# Altium schematic sheet [04]-FT601_USB_Tx_Rx_Interface.SchDoc
size A3
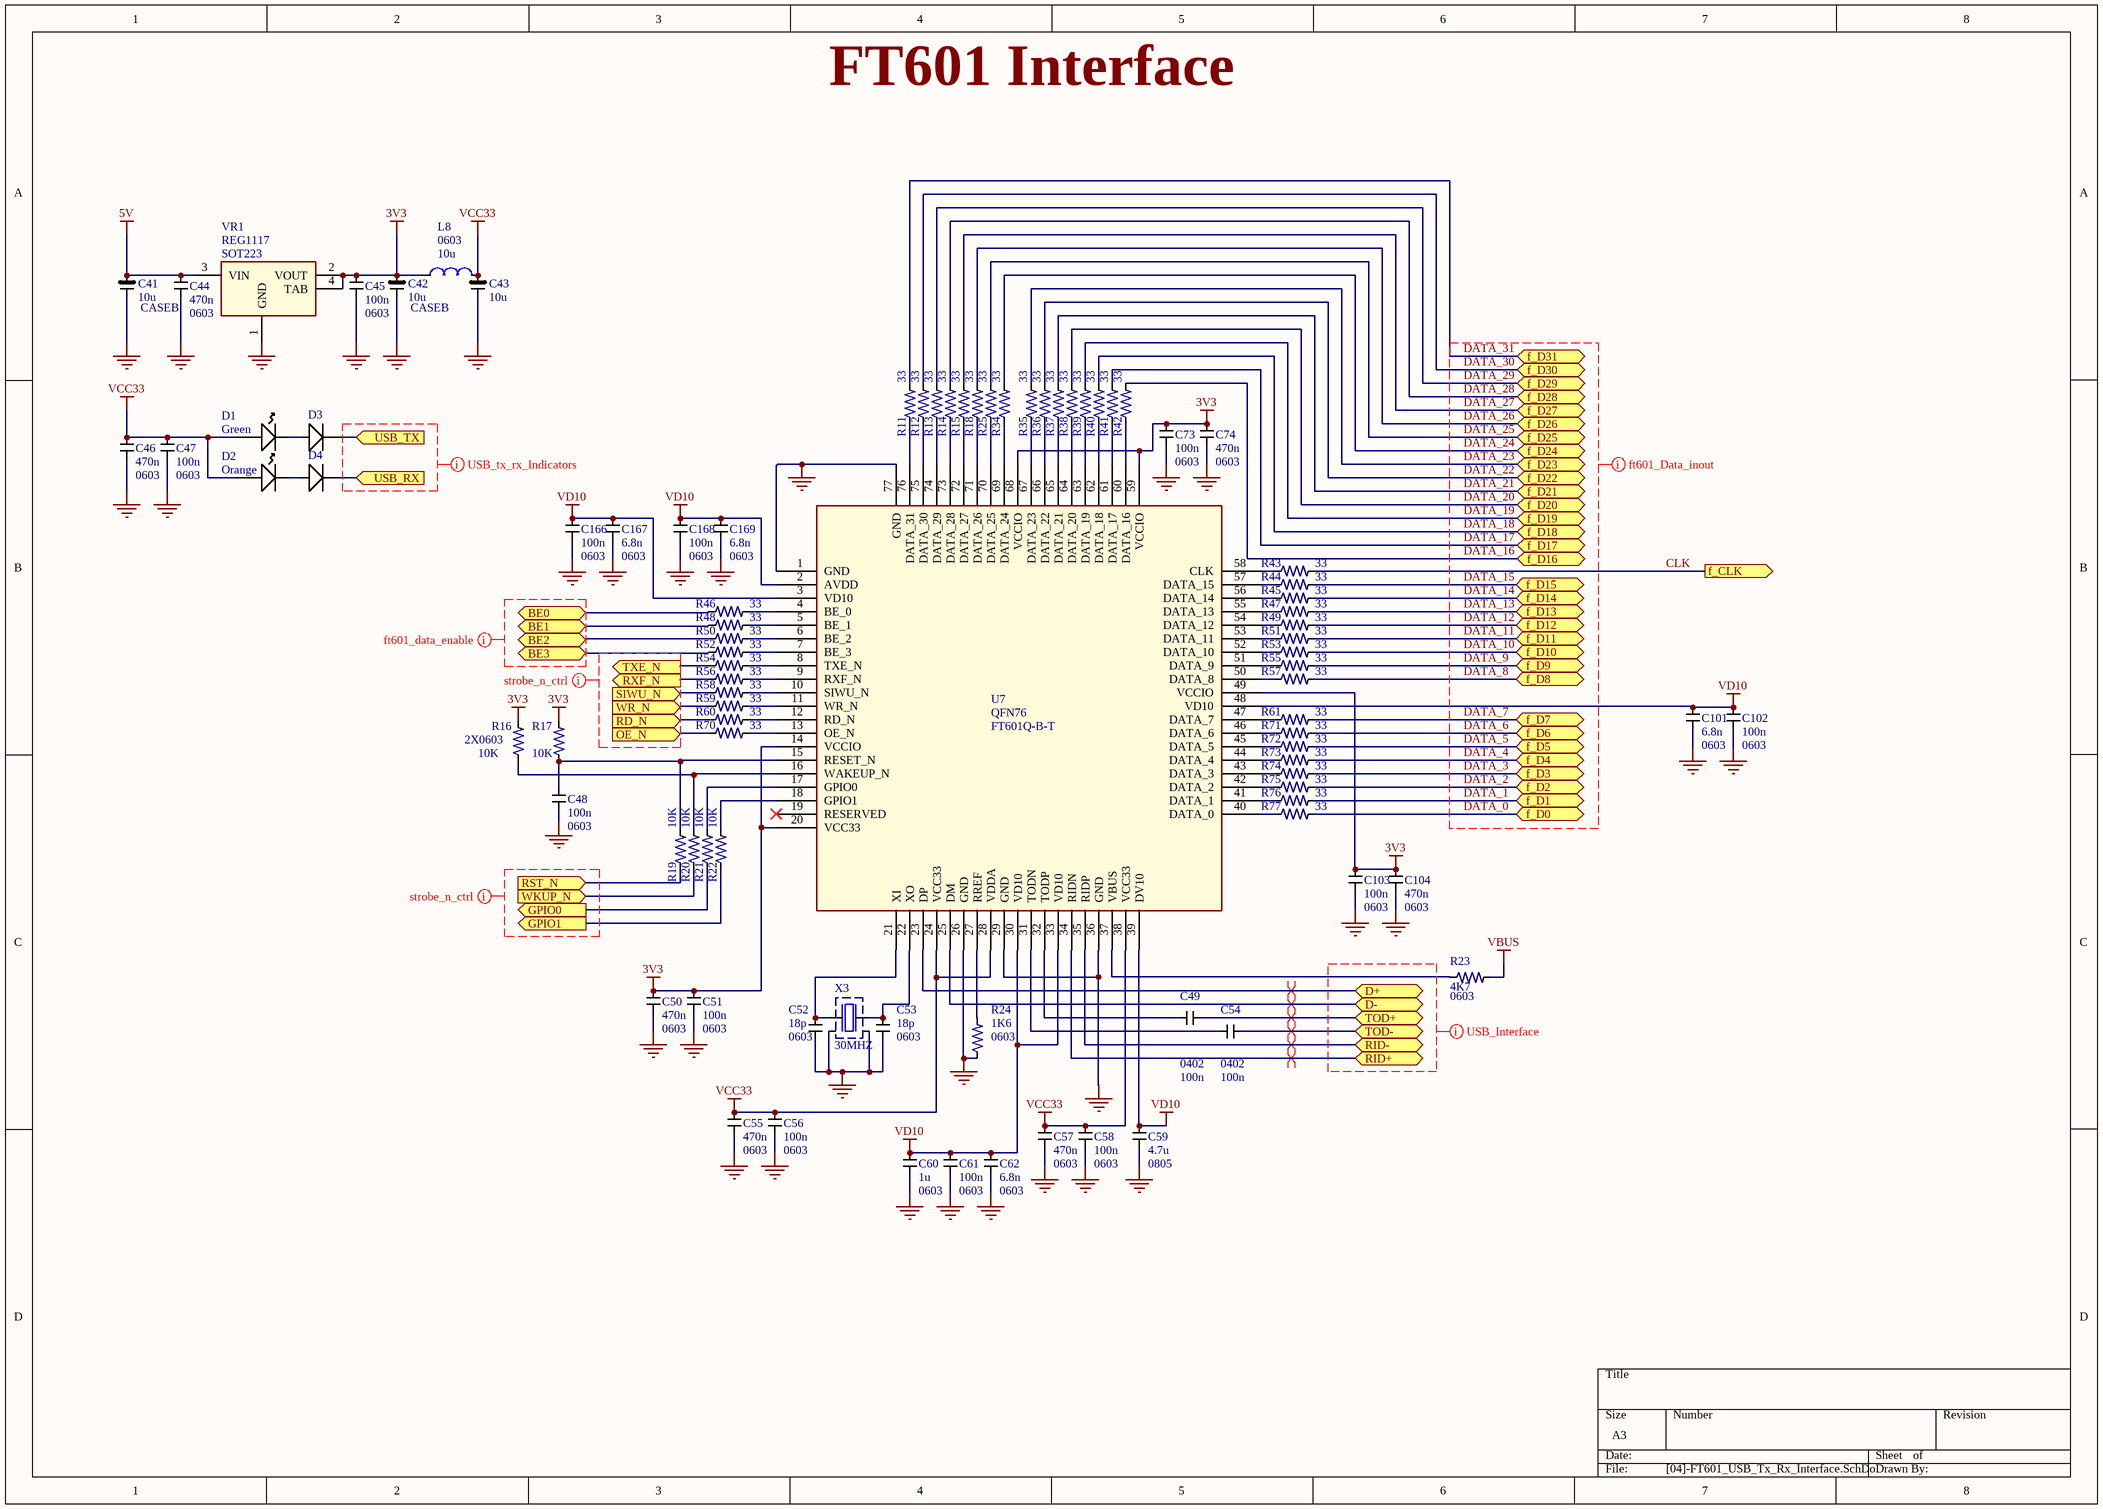
[diagram p0: [04]-FT601_USB_Tx_Rx_Interface.SchDoc]

## Parts
C41  10u  PCB layer: CASEB  [CAPC3528X21N]
C42  10u  PCB layer: CASEB  [CAPC3528X21N]
C43  10u  [CAPC3528X21N]
C44  470n  PCB footprint: 0603
C45  100n  PCB footprint: 0603
C46  470n  PCB footprint: 0603
C47  100n  PCB footprint: 0603
C48  100n  PCB footprint: 0603
C49  100n  PCB Stake: 0402  [*CAPC1005X60N]
C50  470n  PCB footprint: 0603
C51  100n  PCB footprint: 0603
C52  18p  PCB layout:: 0603  [*CAPC1608X90]
C53  18p  PCB layout:: 0603  [*CAPC1608X90]
C54  100n  PCB Stake: 0402  [*CAPC1005X60N]
C55  470n  PCB footprint: 0603
C56  100n  PCB footprint: 0603
C57  470n  PCB footprint: 0603
C58  100n  PCB footprint: 0603
C59  4.7u  PCB Package: 0805  [*CAPC2013X140N]
C60  1u  PCB footprint: 0603
C61  100n  PCB Package: 0603  [CAPC1608X10N]
C62  6.8n  PCB Layer:: 0603  [*0603]
C73  100n  PCB footprint: 0603
C74  470n  PCB footprint: 0603
C101  6.8n  PCB Package: 0603  [CAPC1608X10N]
C102  100n  PCB footprint: 0603
C103  100n  PCB footprint: 0603
C104  470n  PCB footprint: 0603
C166  100n  PCB footprint: 0603
C167  6.8n  PCB footprint: 0603
C168  100n  PCB footprint: 0603
C169  6.8n  PCB footprint: 0603
D1  Color: Green  [LED1913X12NGREEN]  (hidden comment: Kingbright Green LED, 70 mcd 120 ° 0805)
D2  Color: Orange  [LED1913X12NYEL/ORANGE]  (hidden comment: Kingbright Orange LED, 200 mcd 120 ° 0805)
D3  Panasonic DB2J20900L Schottky Diode, 0.5A, 20V, 2.4ns, 2-Pin SMini2 F5 B  [DIOM1712X07N]  (value not drawn)
D4  Panasonic DB2J20900L Schottky Diode, 0.5A, 20V, 2.4ns, 2-Pin SMini2 F5 B  [DIOM1712X07N]  (value not drawn)
L8  10u  PCB Layout:: 0603  [*INDC1608X95N]
R11  33  [*R0402]
R12  33  [*R0402]
R13  33  [*R0402]
R14  33  [*R0402]
R15  33  [*R0402]
R16  10K  foot print: 2X0603  [*0603]
R17  10K  [*0603]
R18  33  [*R0402]
R19  10K  [*0603]
R20  10K  [*0603]
R21  10K  [*0603]
R22  10K  [*0603]
R23  4K7  foot print: 0603  [*RESC1608X50N]
R24  1K6  foot print: 0603  [*0603]
R25  33  [*R0402]
R34  33  [*R0402]
R35  33  [*R0402]
R36  33  [*R0402]
R37  33  [*R0402]
R38  33  [*R0402]
R39  33  [*R0402]
R40  33  [*R0402]
R41  33  [*R0402]
R42  33  [*R0402]
R43  33  [*R0402]
R44  33  [*R0402]
R45  33  [*R0402]
R46  33  [*R0402]
R47  33  [*R0402]
R48  33  [*R0402]
R49  33  [*R0402]
R50  33  [*R0402]
R51  33  [*R0402]
R52  33  [*R0402]
R53  33  [*R0402]
R54  33  [*R0402]
R55  33  [*R0402]
R56  33  [*R0402]
R57  33  [*R0402]
R58  33  [*R0402]
R59  33  [*R0402]
R60  33  [*R0402]
R61  33  [*R0402]
R70  33  [*R0402]
R71  33  [*R0402]
R72  33  [*R0402]
R73  33  [*R0402]
R74  33  [*R0402]
R75  33  [*R0402]
R76  33  [*R0402]
R77  33  [*R0402]
U7  FT601Q-B-T  Package Type:: QFN76  [QFN40P900X900X100-77N]
VR1  REG1117  PCB lAYOUT:: SOT223  [*SOT223]
X3  30MHZ  [OSC_DSC6083CI2A-032K768]

## Ports
BE0 (bidir), BE1 (bidir), BE2 (bidir), BE3 (bidir), D+ (bidir), D- (bidir), f_CLK (out), f_D0 (bidir), f_D1 (bidir), f_D2 (bidir), f_D3 (bidir), f_D4 (bidir), f_D5 (bidir), f_D6 (bidir), f_D7 (bidir), f_D8 (bidir), f_D9 (bidir), f_D10 (bidir), f_D11 (bidir), f_D12 (bidir), f_D13 (bidir), f_D14 (bidir), f_D15 (bidir), f_D16 (bidir), f_D17 (bidir), f_D18 (bidir), f_D19 (bidir), f_D20 (bidir), f_D21 (bidir), f_D22 (bidir), f_D23 (bidir), f_D24 (bidir), f_D25 (bidir), f_D26 (bidir), f_D27 (bidir), f_D28 (bidir), f_D29 (bidir), f_D30 (bidir), f_D31 (bidir), GPIO0 (out), GPIO1 (out), OE_N (in), RD_N (in), RID+ (bidir), RID- (bidir), RST_N (in), RXF_N (out), SIWU_N (in), TOD+ (bidir), TOD- (bidir), TXE_N (out), USB_RX (in), USB_TX (in), WKUP_N (in), WR_N (in)

## Nets
3V3: C42.1 C45.2 C50.2 C51.2 C73.2 C74.2 C103.2 C104.2 L8.1 R16.2 R17.2 U7.14(VCCIO) U7.20(VCC33) U7.49(VCCIO) U7.59(VCCIO) U7.68(VCCIO) VR1.2(VOUT) VR1.4(TAB)
5V: C41.1 C44.2 VR1.3(VIN)
GND: C41.2 C42.2 C43.2 C44.1 C45.1 C46.1 C47.1 C48.1 C50.1 C51.1 C52.1 C53.1 C55.1 C56.1 C57.1 C58.1 C59.1 C60.1 C61.1 C62.1 C73.1 C74.1 C101.1 C102.1 C103.1 C104.1 C166.1 C167.1 C168.1 C169.1 R24.1 U7.1(GND) U7.26(GND) U7.29(GND) U7.36(GND) U7.77(GND) VR1.1(GND) X3.2(Gnd) X3.4(Gnd)
VBUS: R23.2
VCC33: C43.1 C46.2 C47.2 C55.2 C56.2 C57.2 C58.2 D1.1(A) D2.1(A) L8.2 U7.24(VCC33) U7.28(VDDA) U7.38(VCC33)
VD10: C59.2 C60.2 C61.2 C62.2 C101.2 C102.2 C166.2 C167.2 C168.2 C169.2 U7.2(AVDD) U7.3(VD10) U7.30(VD10) U7.33(VD10) U7.39(DV10) U7.48(VD10)
BE0: R46.1 ; port BE0
BE1: R48.1 ; port BE1
BE2: R50.1 ; port BE2
BE3: R52.1 ; port BE3
CLK: R43.2 ; port f_CLK
D+: U7.23(DP) ; port D+
D-: U7.25(DM) ; port D-
DATA_0: R77.2 ; port f_D0
DATA_1: R76.2 ; port f_D1
DATA_2: R75.2 ; port f_D2
DATA_3: R74.2 ; port f_D3
DATA_4: R73.2 ; port f_D4
DATA_5: R72.2 ; port f_D5
DATA_6: R71.2 ; port f_D6
DATA_7: R61.2 ; port f_D7
DATA_8: R57.2 ; port f_D8
DATA_9: R55.2 ; port f_D9
DATA_10: R53.2 ; port f_D10
DATA_11: R51.2 ; port f_D11
DATA_12: R49.2 ; port f_D12
DATA_13: R47.2 ; port f_D13
DATA_14: R45.2 ; port f_D14
DATA_15: R44.2 ; port f_D15
DATA_16: R42.2 ; port f_D16
DATA_17: R41.2 ; port f_D17
DATA_18: R40.2 ; port f_D18
DATA_19: R39.2 ; port f_D19
DATA_20: R38.2 ; port f_D20
DATA_21: R37.2 ; port f_D21
DATA_22: R36.2 ; port f_D22
DATA_23: R35.2 ; port f_D23
DATA_24: R34.2 ; port f_D24
DATA_25: R25.2 ; port f_D25
DATA_26: R18.2 ; port f_D26
DATA_27: R15.2 ; port f_D27
DATA_28: R14.2 ; port f_D28
DATA_29: R13.2 ; port f_D29
DATA_30: R12.2 ; port f_D30
DATA_31: R11.2 ; port f_D31
GPIO0: R21.1 ; port GPIO0
GPIO1: R22.1 ; port GPIO1
OE_N: R70.1 ; port OE_N
RD_N: R60.1 ; port RD_N
RID+: U7.34(RIDN) ; port RID+
RID-: U7.35(RIDP) ; port RID-
RST_N: R19.1 ; port RST_N
RXF_N: R56.1 ; port RXF_N
SIWU_N: R58.1 ; port SIWU_N
TOD+: C49.1 ; port TOD+
TOD-: C54.1 ; port TOD-
TXE_N: R54.1 ; port TXE_N
USB_RX: D4.1 ; port USB_RX
USB_TX: D3.1 ; port USB_TX
WKUP_N: R20.1 ; port WKUP_N
WR_N: R59.1 ; port WR_N
NetC48_2: C48.2 R17.1 R19.2 U7.15(RESET_N)
NetC49_2: C49.2 U7.32(TODP)
NetC52_2: C52.2 U7.21(XI) X3.1
NetC53_2: C53.2 U7.22(XO) X3.3
NetC54_2: C54.2 U7.31(TODN)
NetD1_2: D1.2(K) D3.2
NetD2_2: D2.2(K) D4.2
NetR11_1: R11.1 U7.76(DATA_31)
NetR12_1: R12.1 U7.75(DATA_30)
NetR13_1: R13.1 U7.74(DATA_29)
NetR14_1: R14.1 U7.73(DATA_28)
NetR15_1: R15.1 U7.72(DATA_27)
NetR16_1: R16.1 R20.2 U7.16(WAKEUP_N)
NetR18_1: R18.1 U7.71(DATA_26)
NetR21_2: R21.2 U7.17(GPIO0)
NetR22_2: R22.2 U7.18(GPIO1)
NetR23_1: R23.1 U7.37(VBUS)
NetR24_2: R24.2 U7.27(RREF)
NetR25_1: R25.1 U7.70(DATA_25)
NetR34_1: R34.1 U7.69(DATA_24)
NetR35_1: R35.1 U7.67(DATA_23)
NetR36_1: R36.1 U7.66(DATA_22)
NetR37_1: R37.1 U7.65(DATA_21)
NetR38_1: R38.1 U7.64(DATA_20)
NetR39_1: R39.1 U7.63(DATA_19)
NetR40_1: R40.1 U7.62(DATA_18)
NetR41_1: R41.1 U7.61(DATA_17)
NetR42_1: R42.1 U7.60(DATA_16)
NetR43_1: R43.1 U7.58(CLK)
NetR44_1: R44.1 U7.57(DATA_15)
NetR45_1: R45.1 U7.56(DATA_14)
NetR46_2: R46.2 U7.4(BE_0)
NetR47_1: R47.1 U7.55(DATA_13)
NetR48_2: R48.2 U7.5(BE_1)
NetR49_1: R49.1 U7.54(DATA_12)
NetR50_2: R50.2 U7.6(BE_2)
NetR51_1: R51.1 U7.53(DATA_11)
NetR52_2: R52.2 U7.7(BE_3)
NetR53_1: R53.1 U7.52(DATA_10)
NetR54_2: R54.2 U7.8(TXE_N)
NetR55_1: R55.1 U7.51(DATA_9)
NetR56_2: R56.2 U7.9(RXF_N)
NetR57_1: R57.1 U7.50(DATA_8)
NetR58_2: R58.2 U7.10(SIWU_N)
NetR59_2: R59.2 U7.11(WR_N)
NetR60_2: R60.2 U7.12(RD_N)
NetR61_1: R61.1 U7.47(DATA_7)
NetR70_2: R70.2 U7.13(OE_N)
NetR71_1: R71.1 U7.46(DATA_6)
NetR72_1: R72.1 U7.45(DATA_5)
NetR73_1: R73.1 U7.44(DATA_4)
NetR74_1: R74.1 U7.43(DATA_3)
NetR75_1: R75.1 U7.42(DATA_2)
NetR76_1: R76.1 U7.41(DATA_1)
NetR77_1: R77.1 U7.40(DATA_0)

Not connected (* = marked no-connect by the designer): U7 19(RESERVED)*

## Layout directives
differential pair: D+, D-, RID+, RID-, TOD+, TOD-
mark named ft601_Data_inout: DATA_0, DATA_1, DATA_2, DATA_3, DATA_4, DATA_5, DATA_6, DATA_7, DATA_8, DATA_9, DATA_10, DATA_11, DATA_12, DATA_13, DATA_14, DATA_15, DATA_16, DATA_17, DATA_18, DATA_19, DATA_20, DATA_21, DATA_22, DATA_23, DATA_24, DATA_25, DATA_26, DATA_27, DATA_28, DATA_29, DATA_30, DATA_31
mark named USB_Interface: (no net found under the mark)
mark named USB_tx_rx_Indicators: (no net found under the mark)
mark named ft601_data_enable: (no net found under the mark)
mark named strobe_n_ctrl: (no net found under the mark)

## Notes on the sheet
- FT601 Interface

## Library data of the parts
C41-C62 C73 C74 C101-C104 C166-C169 L8 = Component_1
  C44-C48 C50 C51 C55-C58 C60 C73 C74 C102-C104 C166-C169: Buying URL:: https://uk.farnell.com/avx/06031c104kat2a/cap-0-1-f-100v-10-x7r-0603/dp/2749806?st=100nf
  C49 C54: Buying URL:: https://uk.farnell.com/avx/04023c104kat2a/cap-0-1-f-25v-10-x7r-0402/dp/1867948RL
  C52 C53: Buying URL:: https://uk.farnell.com/avx/06032u180gat2a/cap-18pf-200v-2-c0g-np0-0603-smd/dp/7568339RL
  C59: Buying URL:: https://uk.farnell.com/avx/08053d475kat2a/cap-4-7-f-25v-10-x5r-0805/dp/1657932?st=4.7u%200805
  C61 C101: Buying URL:: https://uk.farnell.com/multicomp/mc0603b682k500ct/cap-6800pf-50v-10-x7r-0603/dp/1759100?st=6.8nf%200603
  C62: Buying URL:: https://uk.farnell.com/avx/0603yc105kat2a/cap-1-f-16v-10-x7r-0603/dp/1658870RL?st=1u%200603
  L8: Buying URL:: https://uk.farnell.com/tdk/mlz1608m100wt/inductor-10uh-20-shielded/dp/2215635?st=10uH%200603
D1 = Kingbright Green LED, 70 mcd 120 ° 0805: Manufacturer Part No.: KP-2012MGC; Forward Voltage: 2.1 V; Creator: Ritesh Kanjee; Date Created: 18 February 2015; Manufacturer: KingBright; RS Stock No.: 466-3778; Datasheet URL: http://za.rs-online.com/web/p/visible-leds/4663778/
D2 = Kingbright Orange LED, 200 mcd 120 ° 0805: Manufacturer Part No.: KP-2012SEC; Forward Voltage: 1.85V; Creator: Ritesh Kanjee; Date Created: 18 February 2015; Manufacturer: KingBright; RS Stock No.: 466-3790; Datasheet URL: http://za.rs-online.com/web/p/visible-leds/4663790/
D3 D4 = Schottky Diode, 0.5A, 20V, 2.4ns, 2-Pin SMini2 F5 B: Created By: R Kanjee; Date Created: 1 March 2015; Manufacturer: Panasonic; RS Stock No.: 713-2703; Manufacturer Part No.: DB2J20900L; Datasheet: http://docs-europe.electrocomponents.com/webdocs/1398/0900766b813986b3.pdf; Maximum Continuous Forward Current: 0.5A; Peak Reverse Repetitive Voltage: 20V
R11-R15 R18 R25 R34-R61 R70-R77 = RP73D1J76R8BTDG: Res Thin Film 0603 76.8 Ohm 0.1% 1/10W Â±15ppm/Â°C Molded SMD Paper T/R; PCB footprint: 0402; Buying URL:: https://uk.farnell.com/yageo/rc0402fr-07100rl/res-100r-1-0-0625w-0402-thick/dp/9239111
R16 R23 R24 = RP73D1J76R8BTDG: Res Thin Film 0603 76.8 Ohm 0.1% 1/10W Â±15ppm/Â°C Molded SMD Paper T/R; MF: TE Connectivity / Holsworthy; Design by: Faheem; Price: None; MP: RP73D1J76R8BTDG; Package: 0603 TE Connectivity / AMP; SnapEDA_Link: https://www.snapeda.com/parts/RP73D1J76R8BTDG/TE%20Connectivity%20/%20Holsworthy/view-part/?ref=snap; Value: *; Availability: Unavailable
  R16 R24: Buying URL:: https://uk.farnell.com/vishay/crcw060310k0fkea/res-10k-1-0-1w-0603-thick-film/dp/1469748?st=CRCW060310K0FKEA
  R23: Buying URL:: https://uk.farnell.com/te-connectivity/crgh0603f4k7/res-4k7-1-0-2w-0603-thick-film/dp/2332011?st=4.7K%200603
R17 = RP73D1J76R8BTDG: Res Thin Film 0603 76.8 Ohm 0.1% 1/10W Â±15ppm/Â°C Molded SMD Paper T/R; MF: TE Connectivity / Holsworthy; Design by: Faheem; foot print: 0603; Price: None; MP: RP73D1J76R8BTDG; Package: 0603 TE Connectivity / AMP; SnapEDA_Link: https://www.snapeda.com/parts/RP73D1J76R8BTDG/TE%20Connectivity%20/%20Holsworthy/view-part/?ref=snap; Value: *; Buying URL:: https://uk.farnell.com/vishay/crcw060310k0fkea/res-10k-1-0-1w-0603-thick-film/dp/1469748?st=CRCW060310K0FKEA; Availability: Unavailable
R19-R22 = RP73D1J76R8BTDG: Res Thin Film 0603 76.8 Ohm 0.1% 1/10W Â±15ppm/Â°C Molded SMD Paper T/R; MF: TE Connectivity / Holsworthy; Design by: Faheem; foot print: 0402; Price: None; MP: RP73D1J76R8BTDG; Package: 0603 TE Connectivity / AMP; SnapEDA_Link: https://www.snapeda.com/parts/RP73D1J76R8BTDG/TE%20Connectivity%20/%20Holsworthy/view-part/?ref=snap; Value: *; Buying URL:: https://uk.farnell.com/vishay/crcw060310k0fkea/res-10k-1-0-1w-0603-thick-film/dp/1469748?st=CRCW060310K0FKEA; Availability: Unavailable
U7 = FT601Q-B-T: USB3.0 to 32bit FIFO Interface Bridge QFN76 Tray; Designer: Faheem Minhas; Company: PhasePhotonics; Data Created: 21-Janruary-2019; Data sheet Link: https://www.ftdichip.com/Support/Documents/DataSheets/ICs/DS_FT600Q-FT601Q%20IC%20Datasheet.pdf; Buying Link: https://uk.farnell.com/ftdi/ft601q-b-t/interface-bridge-usb3-0-to-fifo/dp/2748207?ost=FT601Q-B-T&krypto=%2Bo46xR1L3ajemxFu%2FmPcTNHTx8D7L9nNUVIECkvxkhOZpbouecPBthgwzqoaTTZTVuFe0pU8FARaKQxtxKXba%2BGhPr48jWFZB85DBJ1xakRmBa7tuyYQ%2FzYyjzqRoe3u&ddkey=https%3AInvalidCookie
VR1 = REG1117: LDO Regulator Pos 1.25V to 13.5V 0.8A 4-Pin_3+Tab_ SOT-223 Tube; MF: Texas Instruments; Digi-Key_Part_Number: REG1117-ND; SnapEDA_Link: https://www.snapeda.com/parts/REG1117/Texas%20Instruments/view-part/?ref=snap; Package: SOT-223-4 Texas Instruments; Digi-Key_Purchase_URL: https://www.digikey.co.uk/product-detail/en/texas-instruments/REG1117/REG1117-ND/251211?utm_source=snapeda&utm_medium=aggregator&utm_campaign=symbol; MP: REG1117; Value: *; Buying URL:: https://uk.farnell.com/texas-instruments/reg1117-3-3/ic-v-reg-ldo-0-8a-3-3v-smd-1117/dp/1212355
X3 = Component_1: mf: ABM8G-30.000MHZ-18-D2Y-T; mf Company: ABM8G; Buying URL:: https://uk.rs-online.com/web/p/crystal-units/9047562/